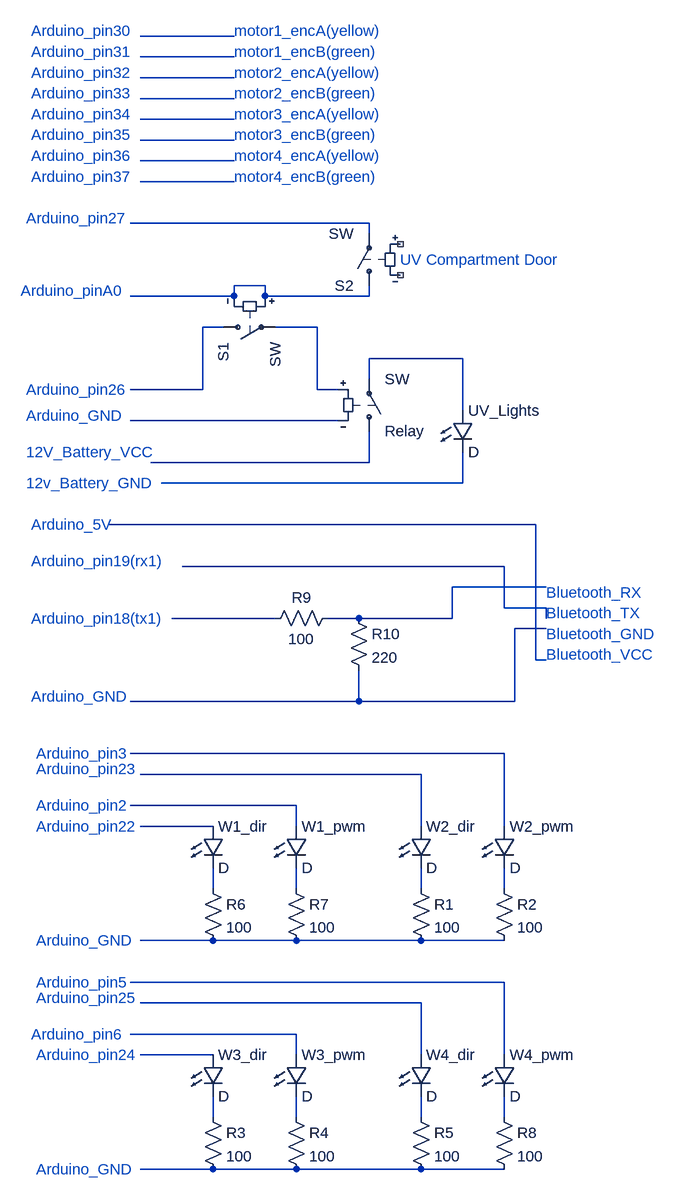
[diagram p0: schematic frogArduino.asc]
frogArduino.asc, the LTspice schematic file:
Version 4
SHEET 1 880 680
WIRE -80 -1360 -224 -1360
WIRE -80 -1328 -224 -1328
WIRE -80 -1296 -224 -1296
WIRE -80 -1264 -224 -1264
WIRE -80 -1232 -224 -1232
WIRE -80 -1200 -224 -1200
WIRE -80 -1168 -224 -1168
WIRE -80 -1136 -224 -1136
WIRE 128 -1072 -240 -1072
WIRE 128 -1056 128 -1072
WIRE -32 -976 -80 -976
WIRE -80 -960 -80 -976
WIRE -80 -960 -240 -960
WIRE -32 -960 -32 -976
WIRE 128 -960 128 -976
WIRE 128 -960 -32 -960
WIRE -96 -912 -128 -912
WIRE 48 -912 -16 -912
WIRE 272 -864 128 -864
WIRE 128 -832 128 -864
WIRE -128 -816 -128 -912
WIRE -128 -816 -240 -816
WIRE 48 -816 48 -912
WIRE 80 -816 48 -816
WIRE 272 -784 272 -864
WIRE 80 -768 -240 -768
WIRE 128 -704 128 -752
WIRE 128 -704 -208 -704
WIRE 272 -672 272 -720
WIRE 272 -672 -192 -672
WIRE 384 -608 -272 -608
WIRE 336 -544 -160 -544
WIRE 400 -512 256 -512
WIRE 336 -480 336 -544
WIRE 400 -480 336 -480
WIRE -16 -464 -176 -464
WIRE 112 -464 64 -464
WIRE 256 -464 256 -512
WIRE 256 -464 112 -464
WIRE 400 -464 400 -480
WIRE 400 -448 352 -448
WIRE 384 -400 384 -608
WIRE 400 -400 384 -400
WIRE 112 -336 112 -384
WIRE 112 -336 -240 -336
WIRE 352 -336 352 -448
WIRE 352 -336 112 -336
WIRE 336 -256 -240 -256
WIRE 208 -224 -224 -224
WIRE 16 -176 -240 -176
WIRE -112 -144 -224 -144
WIRE 16 -144 16 -176
WIRE 208 -144 208 -224
WIRE 336 -144 336 -256
WIRE -112 -48 -112 -80
WIRE 16 -48 16 -80
WIRE 208 -48 208 -80
WIRE 336 -48 336 -80
WIRE -112 32 -224 32
WIRE 16 32 -112 32
WIRE 208 32 16 32
WIRE 336 32 208 32
WIRE 336 96 -240 96
WIRE 208 128 -224 128
WIRE 16 176 -240 176
WIRE -112 208 -224 208
WIRE 16 208 16 176
WIRE 208 208 208 128
WIRE 336 208 336 96
WIRE -112 304 -112 272
WIRE 16 304 16 272
WIRE 208 304 208 272
WIRE 336 304 336 272
WIRE -112 384 -224 384
WIRE 16 384 -112 384
WIRE 208 384 16 384
WIRE 336 384 208 384
SYMBOL LED -128 -144 R0
SYMATTR InstName W1_dir
SYMBOL LED 0 -144 R0
SYMATTR InstName W1_pwm
SYMBOL res -128 -64 R0
SYMATTR InstName R6
SYMATTR Value 100
SYMBOL res 0 -64 R0
SYMATTR InstName R7
SYMATTR Value 100
SYMBOL LED 192 -144 R0
SYMATTR InstName W2_dir
SYMBOL LED 320 -144 R0
SYMATTR InstName W2_pwm
SYMBOL res 192 -64 R0
SYMATTR InstName R1
SYMATTR Value 100
SYMBOL res 320 -64 R0
SYMATTR InstName R2
SYMATTR Value 100
SYMBOL LED -128 208 R0
SYMATTR InstName W3_dir
SYMBOL LED 0 208 R0
SYMATTR InstName W3_pwm
SYMBOL res -128 288 R0
SYMATTR InstName R3
SYMATTR Value 100
SYMBOL res 0 288 R0
SYMATTR InstName R4
SYMATTR Value 100
SYMBOL LED 192 208 R0
SYMATTR InstName W4_dir
SYMBOL LED 320 208 R0
SYMATTR InstName W4_pwm
SYMBOL res 192 288 R0
SYMATTR InstName R5
SYMATTR Value 100
SYMBOL res 320 288 R0
SYMATTR InstName R8
SYMATTR Value 100
SYMBOL res 80 -480 R90
WINDOW 0 0 56 VBottom 2
WINDOW 3 32 56 VTop 2
SYMATTR InstName R9
SYMATTR Value 100
SYMBOL res 96 -480 R0
SYMATTR InstName R10
SYMATTR Value 220
SYMBOL sw 128 -736 M180
SYMATTR InstName Relay
SYMBOL LED 256 -784 R0
SYMATTR InstName UV_Lights
SYMBOL sw -112 -912 M90
SYMATTR InstName S1
SYMBOL sw 128 -960 R180
SYMATTR InstName S2
TEXT -384 -176 Left 2 ;Arduino_pin2
TEXT -384 -144 Left 2 ;Arduino_pin22
TEXT -384 -256 Left 2 ;Arduino_pin3
TEXT -384 -232 Left 2 ;Arduino_pin23
TEXT -392 176 Left 2 ;Arduino_pin6
TEXT -384 208 Left 2 ;Arduino_pin24
TEXT -384 96 Left 2 ;Arduino_pin5
TEXT -384 120 Left 2 ;Arduino_pin25
TEXT -392 -552 Left 2 ;Arduino_pin19(rx1)
TEXT -392 -464 Left 2 ;Arduino_pin18(tx1)
TEXT 400 -504 Left 2 ;Bluetooth_RX
TEXT 400 -472 Left 2 ;Bluetooth_TX
TEXT 400 -440 Left 2 ;Bluetooth_GND
TEXT 400 -408 Left 2 ;Bluetooth_VCC
TEXT -392 -344 Left 2 ;Arduino_GND
TEXT -392 -608 Left 2 ;Arduino_5V
TEXT -384 32 Left 2 ;Arduino_GND
TEXT -384 384 Left 2 ;Arduino_GND
TEXT -400 -816 Left 2 ;Arduino_pin26
TEXT -400 -672 Left 2 ;12v_Battery_GND
TEXT -400 -720 Left 2 ;12V_Battery_VCC
TEXT -400 -1080 Left 2 ;Arduino_pin27
TEXT -408 -968 Left 2 ;Arduino_pinA0
TEXT 176 -1016 Left 2 ;UV Compartment Door
TEXT -400 -776 Left 2 ;Arduino_GND
TEXT -392 -1368 Left 2 ;Arduino_pin30
TEXT -392 -1336 Left 2 ;Arduino_pin31
TEXT -392 -1304 Left 2 ;Arduino_pin32
TEXT -392 -1272 Left 2 ;Arduino_pin33
TEXT -392 -1240 Left 2 ;Arduino_pin34
TEXT -392 -1208 Left 2 ;Arduino_pin35
TEXT -392 -1176 Left 2 ;Arduino_pin36
TEXT -392 -1144 Left 2 ;Arduino_pin37
TEXT -80 -1368 Left 2 ;motor1_encA(yellow)
TEXT -80 -1304 Left 2 ;motor2_encA(yellow)
TEXT -80 -1240 Left 2 ;motor3_encA(yellow)
TEXT -80 -1176 Left 2 ;motor4_encA(yellow)
TEXT -80 -1336 Left 2 ;motor1_encB(green)
TEXT -80 -1272 Left 2 ;motor2_encB(green)
TEXT -80 -1208 Left 2 ;motor3_encB(green)
TEXT -80 -1144 Left 2 ;motor4_encB(green)

The netlist it stands for:
* frogArduino.asc
D§W1_dir N025 N026 D
D§W1_pwm N024 N027 D
R6 N026 N030 100
R7 N027 N030 100
D§W2_dir N023 N028 D
D§W2_pwm N022 N029 D
R1 N028 N030 100
R2 N029 N030 100
D§W3_dir N034 N035 D
D§W3_pwm N033 N036 D
R3 N035 N039 100
R4 N036 N039 100
D§W4_dir N032 N037 D
D§W4_pwm N031 N038 D
R5 N037 N039 100
R8 N038 N039 100
R9 N019 N020 100
R10 N019 N021 220
S§Relay N015 N013 N012 N014 SW
D§UV_Lights N013 N016 D
S1 N011 N012 N010 N010 SW
S2 N010 N009 NC_01 NC_02 SW
.model D D
.lib standard.dio
* Arduino_pin2
* Arduino_pin22
* Arduino_pin3
* Arduino_pin23
* Arduino_pin6
* Arduino_pin24
* Arduino_pin5
* Arduino_pin25
* Arduino_pin19(rx1)
* Arduino_pin18(tx1)
* Bluetooth_RX
* Bluetooth_TX
* Bluetooth_GND
* Bluetooth_VCC
* Arduino_GND
* Arduino_5V
* Arduino_GND
* Arduino_GND
* Arduino_pin26
* 12v_Battery_GND
* 12V_Battery_VCC
* Arduino_pin27
* Arduino_pinA0
* UV Compartment Door
* Arduino_GND
* Arduino_pin30
* Arduino_pin31
* Arduino_pin32
* Arduino_pin33
* Arduino_pin34
* Arduino_pin35
* Arduino_pin36
* Arduino_pin37
* motor1_encA(yellow)
* motor2_encA(yellow)
* motor3_encA(yellow)
* motor4_encA(yellow)
* motor1_encB(green)
* motor2_encB(green)
* motor3_encB(green)
* motor4_encB(green)
.backanno
.end